# EasyEDA Pro project ProProject_TLE5012B_8pin_2024-05-29.epro

# Schematic Schematic1
Create Date: 2024-01-12; Page Name: P1; Project Name: TLE5012B_8pin; Schematic Name: Schematic1; Update Date: 2024-01-12; Company: 嘉立创EDA; Page Size: A4; Version: V1.0
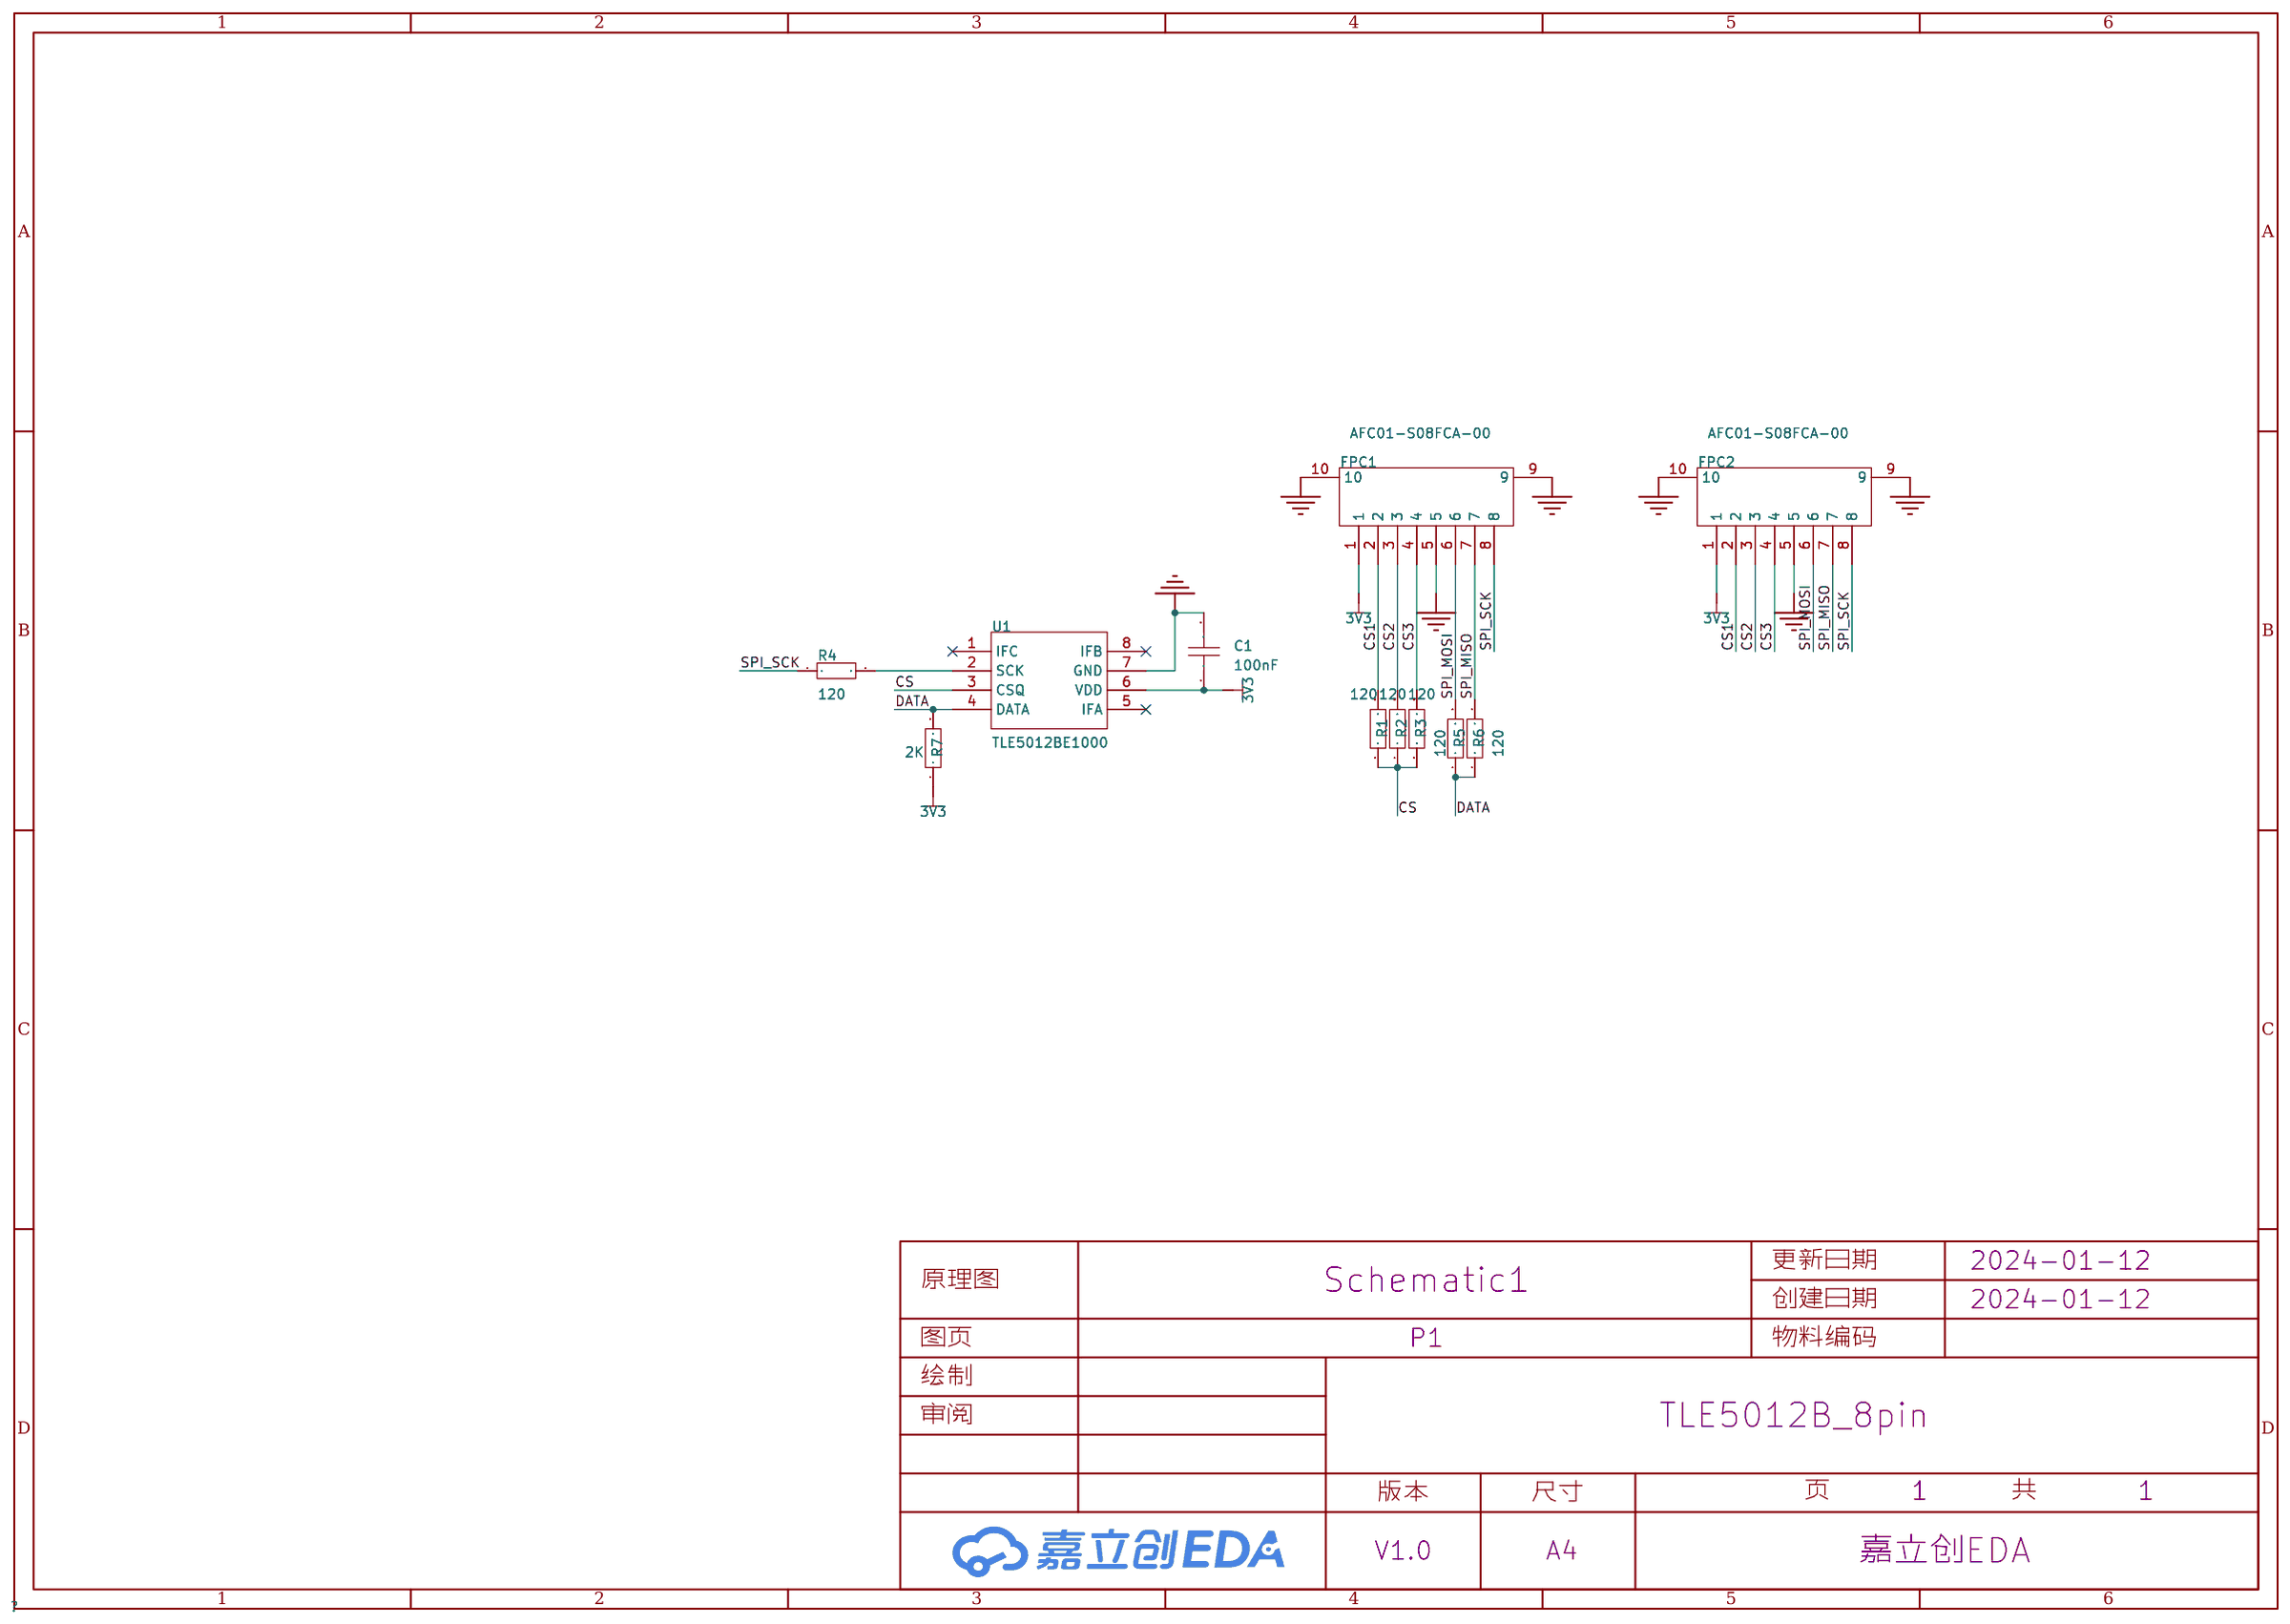
[diagram p0: schematic sheet]

## Parts
C1  100nF  [C0402]
FPC1  AFC01-S08FCA-00  [FPC-SMD_P0.50-8P_FGS-XJ-H2.0]
FPC2  AFC01-S08FCA-00  [FPC-SMD_P0.50-8P_FGS-XJ-H2.0]
R1  120  [R0402]
R2  120  [R0402]
R3  120  [R0402]
R4  120  [R0402]
R5  120  [R0402]
R6  120  [R0402]
R7  2K  [R0402]
U1  TLE5012BE1000  [PG-DSO-8_L5.0-W4.0-P1.27-LS6.0-BL]

## Library data of the parts
C1 = CAP_0402: Supplier Footprint: 0402
FPC1 FPC2 = AFC01-S08FCA-00: 间距:0.5mm;触点数量:8P;锁定特性:翻盖式;触点类型:下接;安装类型:卧贴;; LCSC Part Name: 间距:0.5mm P数:8P 翻盖式 下接; Supplier Part: C262657; Manufacturer: JS(钜硕电子); Supplier Footprint: SMD,P=0.5mm; JLCPCB Part Class: 扩展库; Datasheet: https://atta.szlcsc.com/upload/public/pdf/source/20190816/C413942_2A72D1AC756EAE17EEDF756A339D4500.pdf; Supplier: LCSC; Pitch: 0.5mm; Number of Contacts: 8P; Locking Feature: 翻盖式; FFC, FCB Thickness: 0.3mm; Contact Type: 下接; Mounting Type: 卧贴; Height Above Board: 2mm
R1-R7 = Res_0402: Supplier Footprint: 0402
U1 = TLE5012BE1000: 采用巨磁电阻的角度传感器; Supplier Part: C123083; Manufacturer: Infineon(英飞凌); Supplier Footprint: SO-8; JLCPCB Part Class: 扩展库; Datasheet: https://atta.szlcsc.com/upload/public/pdf/source/20170728/C123083_1501225763065848823.pdf; Supplier: LCSC

## Nets
3V3: C1.1 FPC1.1 FPC2.1 R7.1 U1.6(VDD)
GND: C1.2 FPC1.5 FPC1.9 FPC1.10 FPC2.5 FPC2.9 FPC2.10 U1.7(GND)
CS: R1.1 R2.1 R3.1 U1.3(CSQ)
CS1: FPC1.2 FPC2.2 R1.2
CS2: FPC1.3 FPC2.3 R2.2
CS3: FPC1.4 FPC2.4 R3.2
DATA: R5.1 R6.1 R7.2 U1.4(DATA)
SPI_MISO: FPC1.7 FPC2.7 R6.2
SPI_MOSI: FPC1.6 FPC2.6 R5.2
SPI_SCK: FPC1.8 FPC2.8 R4.1
$1N546: R4.2 U1.2(SCK)

Not connected (* = marked no-connect by the designer): U1 1(IFC)* 5(IFA)* 8(IFB)*

# Board PCB1
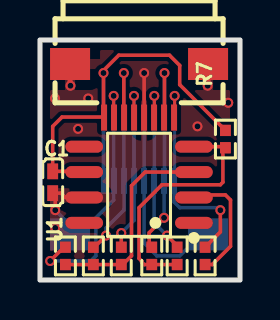
[diagram p1: board, top side]
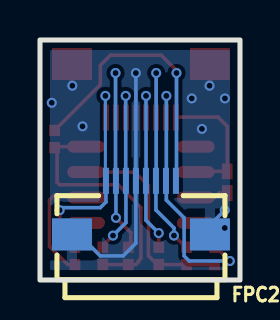
[diagram p2: board, bottom side, seen from below]

Outline 10 x 12 mm; copper layers: Top Layer, Bottom Layer. Coordinates in mm from the lower left corner of the outline.
Outline path: rectangle 0,12 10,0
Stack: Top Layer 0.035mm / Dielectric1 1.51mm FR4 er 4.5 / Bottom Layer 0.035mm

## Design rules (mm)
template: 自定义配置
spacing copperThickness1oz (default): track to track 0.102, other pairs 0.152 to 0.3
spacing copperThickness2oz: track to track 0.203, other pairs 0.152 to 0.3
track width copperThickness1oz (default): min 0.127, default 0.254, max 2.54
track width copperThickness2oz: min 0.203, default 0.254, max 2.54
differential pair differentialPair (default): width min 0.127, default 0.254, max 2.54; gap min 0.152, default 0.152
via viaSize (default): diameter min 0.5, default 0.5, max 10; hole min 0.3, default 0.3, max 6.299

## Placement (name value [footprint] x y rotation side)
C1  100nF  [C0402]  0.63 4.89 270 top
FPC1  AFC01-S08FCA-00  [FPC-SMD_P0.50-8P_FGS-XJ-H2.0]  4.95 9.46 0 top
FPC2  AFC01-S08FCA-00  [FPC-SMD_P0.50-8P_FGS-XJ-H2.0]  4.95 3.62 0 bottom
R1  120  [R0402]  1.27 1.2 90 top
R2  120  [R0402]  2.67 1.2 90 top
R3  120  [R0402]  4.06 1.2 90 top
R4  120  [R0402]  8.25 1.2 270 top
R5  120  [R0402]  6.86 1.2 90 top
R6  120  [R0402]  5.59 1.2 90 top
R7  2K  [R0402]  9.27 7.05 270 top
U1  TLE5012BE1000  [PG-DSO-8_L5.0-W4.0-P1.27-LS6.0-BL]  4.95 4.76 90 top

## Footprints (pads in the part's own frame, mm; a bottom-side part is the same pattern mirrored in y, then rotated)
C0402
  rect 0.79x0.54 smd: 1(-0.545,0) 2(0.545,0)
FPC-SMD_P0.50-8P_FGS-XJ-H2.0
  rect 0.3x1.3 smd: 1(-1.75,-1.34) 2(-1.252,-1.339) 3(-0.75,-1.34) 4(-0.25,-1.34) 5(0.25,-1.34) 6(0.75,-1.34) 7(1.25,-1.34) 8(1.75,-1.34)
  rect 2x1.6 smd: 9(3.45,1.34) 10(-3.45,1.34)
PG-DSO-8_L5.0-W4.0-P1.27-LS6.0-BL
  oval 0.602x1.885 smd: 1(-1.905,-2.743) 2(-0.635,-2.743) 3(0.635,-2.743) 4(1.905,-2.743) 5(1.905,2.743) 6(0.635,2.743) 7(-0.635,2.743) 8(-1.905,2.743)
R0402
  rect 0.566x0.54 smd: 1(-0.433,0) 2(0.433,0)

## Nets
As in the schematic.

Pads without a net: U1 1 5 8

## Via types
v1: diameter 0.5, hole 0.3, Top Layer to Bottom Layer, 23 vias

## Routing (per net, layer and track width the routed paths; a pad name or vN(x,y) marks a point on that pad's centre or on a via; arc(x,y) is an arc through that point)
3V3: length 22.9
  Top Layer w0.178: U1.6 2.17,5.43 C1.1 0.63,7.68 1.1,8.15 3.18,8.15 ; 3.18,8.15 FPC1.1 ; 3.18,8.15 v1(3.18,10.35) 3.18,10.48 3.94,11.24 6.48,11.24 6.99,10.73 6.99,9.77 R7.1
  Bottom Layer w0.178: FPC2.1 3.18,4.99 v1(3.18,10.35)
GND: length 20.9
  Top Layer w0.178: v1(5.21,10.35) 5.21,8.12 FPC1.5 ; U1.7 1.27,4.13 1.05,4.34 C1.2 0.76,4.22 v1(0.76,3.49)
  Top Layer w0.254: v1(1.52,9.71) 1.5,9.73 FPC1.10 ; v1(8.38,9.71) 8.4,9.73 FPC1.9
  Bottom Layer w0.178: v1(5.21,10.35) 5.21,4.96 FPC2.5 5.21,4.95 5.21,1.84 5.84,1.2 6.99,1.2 8.06,2.28 FPC2.9 ; v1(0.76,3.49) 1.5,2.75 FPC2.10
  vias: v1(0.75,9.08) v1(0.76,2.6) v1(1.91,7.56) v1(2.41,9.08) v1(7.87,7.68) v1(9.41,8.86)
CS: length 10.4
  Top Layer w0.178: U1.3 5.26,5.4 4.58,4.71 4.58,1.21 4.14,0.77 R3.1 R2.1 R1.1
CS1: length 12.9
  Top Layer w0.152: v1(3.68,9.21) 3.68,8.14 FPC1.2
  Top Layer w0.178: v1(0.51,0.95) 1.19,1.64 R1.2
  Bottom Layer w0.178: v1(3.68,9.21) 3.68,4.97 ; 3.68,4.97 FPC2.2 ; 3.68,4.97 3.68,4 2.79,3.11 2.79,1.2 2.54,0.95 v1(0.51,0.95)
CS2: length 11.6
  Top Layer w0.178: v1(3.3,2.22) 2.72,1.64 R2.2 ; v1(4.19,10.35) 4.19,8.13 FPC1.3
  Bottom Layer w0.178: v1(4.19,10.35) 4.19,4.97 FPC2.3 4.2,3.5 3.3,2.6 v1(3.3,2.22)
CS3: length 8.9
  Top Layer w0.152: FPC1.4 4.7,8.12 v1(4.7,9.21)
  Top Layer w0.178: v1(4.06,2.35) R3.2
  Bottom Layer w0.178: v1(4.06,2.35) 4.7,2.99 FPC2.4 4.7,4.96 v1(4.7,9.21)
DATA: length 12.7
  Top Layer w0.178: U1.4 9.22,6.67 R7.2 9.14,6.49 9.14,4.89 9.02,4.76 6.1,4.76 4.95,3.62 4.95,1.08 5.08,0.95 5.08,0.9 5.21,0.77 R6.1 R5.1
SPI_MISO: length 11.3
  Top Layer w0.178: v1(6.22,10.35) 6.22,8.14 FPC1.7 ; 5.46,1.64 5.46,2.37 v1(6.2,3.11)
  Bottom Layer w0.178: v1(6.22,10.35) 6.22,4.98 FPC2.7 v1(6.2,3.11)
SPI_MOSI: length 9.1
  Top Layer w0.152: v1(5.72,9.21) 5.72,8.13 FPC1.6
  Top Layer w0.178: v1(6.35,2.22) 6.86,1.71 R5.2
  Bottom Layer w0.178: v1(6.35,2.22) 5.7,2.87 FPC2.6 5.72,4.97 v1(5.72,9.21)
SPI_SCK: length 11.1
  Top Layer w0.152: v1(6.73,9.21) 6.73,8.15 FPC1.8
  Top Layer w0.178: R4.1 9.02,2.4 v1(9.02,3.49)
  Bottom Layer w0.152: FPC2.8 6.73,4.99 v1(6.73,9.21)
  Bottom Layer w0.178: FPC2.8 6.7,3.9 6.99,3.62 8.89,3.62 v1(9.02,3.49)
$1N546: length 6
  Top Layer w0.178: R4.2 8.61,0.77 9.53,1.68 9.53,4 9.27,4.25 7.82,4.25 U1.2

## Copper pours and planes (outline as drawn; the poured copper is in the pictures)
GND on Top Layer: -3.56,15.05 12.95,15.05 12.95,-3.62 -3.56,-3.62
GND on Bottom Layer: -4.57,15.43 13.21,15.43 13.21,-4.51 -4.57,-4.51

# Board PCB2
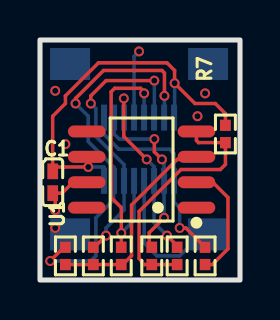
[diagram p3: board, top side]
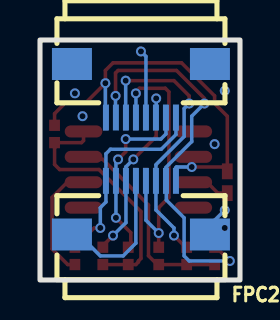
[diagram p4: board, bottom side, seen from below]

Outline 10 x 12 mm; copper layers: Top Layer, Bottom Layer. Coordinates in mm from the lower left corner of the outline.
Outline path: rectangle 0,12 10,0
Stack: Top Layer 0.035mm / Dielectric1 1.51mm FR4 er 4.5 / Bottom Layer 0.035mm

## Design rules (mm)
template: 自定义配置
spacing copperThickness1oz (default): track to track 0.102, other pairs 0.152 to 0.3
spacing copperThickness2oz: track to track 0.203, other pairs 0.152 to 0.3
track width copperThickness1oz (default): min 0.127, default 0.254, max 2.54
track width copperThickness2oz: min 0.203, default 0.254, max 2.54
differential pair differentialPair (default): width min 0.127, default 0.254, max 2.54; gap min 0.152, default 0.152
via viaSize (default): diameter min 0.5, default 0.5, max 10; hole min 0.3, default 0.3, max 6.299

## Placement (name value [footprint] x y rotation side)
C1  100nF  [C0402]  0.63 4.89 270 top
FPC1  AFC01-S08FCA-00  [FPC-SMD_P0.50-8P_FGS-XJ-H2.0]  4.95 9.46 180 bottom
FPC2  AFC01-S08FCA-00  [FPC-SMD_P0.50-8P_FGS-XJ-H2.0]  4.95 3.62 0 bottom
R1  120  [R0402]  1.27 1.2 90 top
R2  120  [R0402]  2.67 1.2 90 top
R3  120  [R0402]  4.06 1.2 90 top
R4  120  [R0402]  8.25 1.2 270 top
R5  120  [R0402]  6.86 1.2 90 top
R6  120  [R0402]  5.59 1.2 90 top
R7  2K  [R0402]  9.27 7.3 270 top
U1  TLE5012BE1000  [PG-DSO-8_L5.0-W4.0-P1.27-LS6.0-BL]  5.08 5.52 90 top

## Footprints (pads in the part's own frame, mm; a bottom-side part is the same pattern mirrored in y, then rotated)
C0402
  rect 0.79x0.54 smd: 1(-0.545,0) 2(0.545,0)
FPC-SMD_P0.50-8P_FGS-XJ-H2.0
  rect 0.3x1.3 smd: 1(-1.75,-1.34) 2(-1.252,-1.339) 3(-0.75,-1.34) 4(-0.25,-1.34) 5(0.25,-1.34) 6(0.75,-1.34) 7(1.25,-1.34) 8(1.75,-1.34)
  rect 2x1.6 smd: 9(3.45,1.34) 10(-3.45,1.34)
PG-DSO-8_L5.0-W4.0-P1.27-LS6.0-BL
  oval 0.602x1.885 smd: 1(-1.905,-2.743) 2(-0.635,-2.743) 3(0.635,-2.743) 4(1.905,-2.743) 5(1.905,2.743) 6(0.635,2.743) 7(-0.635,2.743) 8(-1.905,2.743)
R0402
  rect 0.566x0.54 smd: 1(-0.433,0) 2(0.433,0)

## Nets
3V3: C1.1 FPC1.1 FPC2.1 R7.1 U1.6
GND: C1.2 FPC1.5 FPC1.9 FPC1.10 FPC2.5 FPC2.9 FPC2.10 U1.7
CS: R1.1 R2.1 R3.1 U1.3
CS1: FPC1.2 FPC2.2 R1.2
CS2: FPC1.3 FPC2.3 R2.2
CS3: FPC1.4 FPC2.4 R3.2
DATA: R5.1 R6.1 R7.2 U1.4
SPI_MISO: FPC1.7 FPC2.7 R6.2
SPI_MOSI: FPC1.6 FPC2.6 R5.2
SPI_SCK: FPC1.8 FPC2.8 R4.1
$1N546: R4.2 U1.2

Pads without a net: U1 1 5 8

## Via types
v1: diameter 0.5, hole 0.299, Top Layer to Bottom Layer, 11 vias
v2: diameter 0.5, hole 0.3, Top Layer to Bottom Layer, 13 vias

## Routing (per net, layer and track width the routed paths; a pad name or vN(x,y) marks a point on that pad's centre or on a via; arc(x,y) is an arc through that point)
3V3: length 19.8
  Top Layer w0.178: v1(2.41,5.65) 0.85,5.65 C1.1 0.63,8.19 1.27,8.83 1.27,9.21 2.92,10.86 6.35,10.86 6.73,10.48 v1(6.73,9.84) 7.75,8.83 8.76,8.83 9.27,8.32 R7.1
  Bottom Layer w0.178: v1(6.73,9.84) 6.73,8.15 FPC1.1 ; FPC2.1 3.2,5.62 3.18,5.65 v1(2.41,5.65)
GND: length 14.2
  Top Layer w0.178: 1.78,4.76 1.52,4.76 1.11,4.34 C1.2 0.76,4.22 v2(0.76,3.49)
  Bottom Layer w0.178: v2(4.95,11.43) 4.7,11.18 FPC1.5 ; FPC2.5 5.21,4.95 5.21,1.84 5.84,1.2 6.99,1.2 8.06,2.28 FPC2.9 ; FPC2.10 1.5,2.75 v2(0.76,3.49)
  vias: v2(0.76,9.46) v2(0.76,2.6) v2(1.27,6.79) v2(7.87,8.19) v2(8.25,9.33)
CS: length 10.7
  Top Layer w0.178: 8.33,6.03 6.86,6.03 4.58,3.75 4.58,1.21 4.14,0.77 R3.1 R2.1 R1.1
CS1: length 19.8
  Top Layer w0.178: v2(0.51,0.95) 1.19,1.64 R1.2 ; v1(6.22,9.21) 6.22,10.35 6.1,10.48 3.18,10.48 1.78,9.08 v1(1.78,8.83)
  Bottom Layer w0.178: FPC1.2 6.22,8.14 v1(6.22,9.21) ; v1(1.78,8.83) 2.41,8.19 2.41,6.92 3.7,5.63 FPC2.2 3.68,4.97 3.68,4 2.79,3.11 2.79,1.2 2.54,0.95 v2(0.51,0.95)
CS2: length 14.3
  Top Layer w0.178: v1(5.72,9.97) 3.3,9.97 2.54,9.21 v1(2.54,8.83) ; R2.2 2.72,1.64 v2(3.3,2.22)
  Bottom Layer w0.178: v2(3.3,2.22) 3.3,2.6 4.2,3.5 FPC2.3 4.2,5.77 2.79,7.17 2.79,8.57 v1(2.54,8.83) ; v1(5.72,9.97) 5.72,8.13 FPC1.3
CS3: length 14
  Top Layer w0.178: v1(5.21,9.33) 5.21,9.41 5.03,9.59 3.73,9.59 3.56,9.41 3.56,4.13 4.06,3.62 v2(4.06,2.35) R3.2
  Bottom Layer w0.178: 4.7,4.96 FPC2.4 4.7,2.99 v2(4.06,2.35) ; v1(5.21,9.33) 5.2,9.33 FPC1.4
DATA: length 12.8
  Top Layer w0.178: R5.1 R6.1 5.21,0.77 5.08,0.9 5.08,0.95 4.95,1.08 4.95,3.43 7.05,5.52 9.02,5.52 9.27,5.78 9.27,6.61 9.22,6.67 9.22,6.82 R7.2 7.93,6.87 7.82,6.97 U1.4
SPI_MISO: length 8.9
  Top Layer w0.178: v1(6.1,6.03) 5.72,6.41 v1(5.72,7.05) ; 5.46,1.64 5.46,2.37 v2(6.2,3.11)
  Bottom Layer w0.178: v1(5.72,7.05) 3.96,7.05 3.7,7.3 FPC1.7 ; v1(6.1,6.03) 6.2,5.92 FPC2.7 v2(6.2,3.11)
SPI_MOSI: length 9.5
  Top Layer w0.178: R5.2 6.86,1.71 v2(6.35,2.22) ; v1(5.33,6.03) 4.19,7.17 v1(4.19,9.08)
  Bottom Layer w0.178: v1(5.33,6.03) 5.7,5.66 FPC2.6 ; FPC2.6 5.72,4.97 ; FPC2.6 5.7,2.87 v2(6.35,2.22) ; v1(4.19,9.08) 4.19,8.13 FPC1.6
SPI_SCK: length 10.2
  Top Layer w0.178: v2(6.99,2.6) 7.29,2.6 R4.1
  Bottom Layer w0.178: FPC1.8 3.2,7.27 3.94,6.54 6.48,6.54 6.7,6.31 FPC2.8 6.7,3.9 6.99,3.62 v2(6.99,2.6)
$1N546: length 5.9
  Top Layer w0.178: R4.2 8.61,0.77 9.4,1.56 9.4,4.13 8.64,4.89 U1.2

# Board PCB3
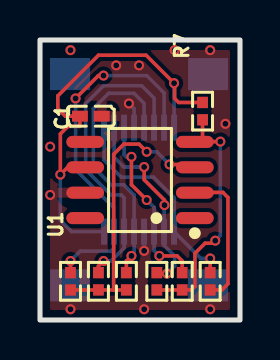
[diagram p5: board, top side]
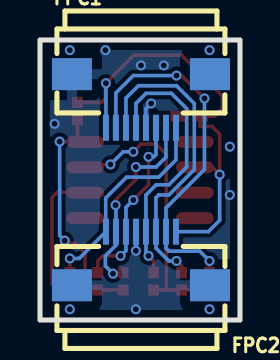
[diagram p6: board, bottom side, seen from below]

Outline 10 x 14 mm; copper layers: Top Layer, Bottom Layer. Coordinates in mm from the lower left corner of the outline.
Outline path: rectangle 0,14 10,0
Stack: Top Layer 0.035mm / Dielectric1 1.51mm FR4 er 4.5 / Bottom Layer 0.035mm

## Design rules (mm)
template: 自定义配置
spacing copperThickness1oz (default): track to track 0.102, other pairs 0.152 to 0.3
spacing copperThickness2oz: track to track 0.203, other pairs 0.152 to 0.3
track width copperThickness1oz (default): min 0.127, default 0.254, max 2.54
track width copperThickness2oz: min 0.203, default 0.254, max 2.54
differential pair differentialPair (default): width min 0.127, default 0.254, max 2.54; gap min 0.152, default 0.152
via viaSize (default): diameter min 0.5, default 0.5, max 10; hole min 0.3, default 0.3, max 6.299

## Placement (name value [footprint] x y rotation side)
C1  100nF  [C0402]  2.54 10.19 0 top
FPC1  AFC01-S08FCA-00  [FPC-SMD_P0.50-8P_FGS-XJ-H2.0]  4.95 10.95 180 bottom
FPC2  AFC01-S08FCA-00  [FPC-SMD_P0.50-8P_FGS-XJ-H2.0]  4.95 3.08 0 bottom
R1  120  [R0402]  1.52 1.94 90 top
R2  120  [R0402]  2.92 1.94 90 top
R3  120  [R0402]  4.32 1.94 90 top
R4  120  [R0402]  8.51 1.94 270 top
R5  120  [R0402]  7.11 1.94 90 top
R6  120  [R0402]  5.84 1.94 90 top
R7  2K  [R0402]  8.13 10.44 270 top
U1  TLE5012BE1000  [PG-DSO-8_L5.0-W4.0-P1.27-LS6.0-BL]  5 7 90 top

## Footprints (pads in the part's own frame, mm; a bottom-side part is the same pattern mirrored in y, then rotated)
C0402
  rect 0.79x0.54 smd: 1(-0.545,0) 2(0.545,0)
FPC-SMD_P0.50-8P_FGS-XJ-H2.0
  rect 0.3x1.3 smd: 1(-1.75,-1.34) 2(-1.252,-1.339) 3(-0.75,-1.34) 4(-0.25,-1.34) 5(0.25,-1.34) 6(0.75,-1.34) 7(1.25,-1.34) 8(1.75,-1.34)
  rect 2x1.6 smd: 9(3.45,1.34) 10(-3.45,1.34)
PG-DSO-8_L5.0-W4.0-P1.27-LS6.0-BL
  oval 0.602x1.885 smd: 1(-1.905,-2.743) 2(-0.635,-2.743) 3(0.635,-2.743) 4(1.905,-2.743) 5(1.905,2.743) 6(0.635,2.743) 7(-0.635,2.743) 8(-1.905,2.743)
R0402
  rect 0.566x0.54 smd: 1(-0.433,0) 2(0.433,0)

## Nets
3V3: C1.1 FPC1.1 FPC2.1 R7.1 U1.6
GND: C1.2 FPC1.5 FPC1.9 FPC1.10 FPC2.5 FPC2.9 FPC2.10 U1.7
CS: R1.1 R2.1 R3.1 U1.3
CS1: FPC1.2 FPC2.2 R1.2
CS2: FPC1.3 FPC2.3 R2.2
CS3: FPC1.4 FPC2.4 R3.2
DATA: R5.1 R6.1 R7.2 U1.4
SPI_MISO: FPC1.7 FPC2.7 R6.2
SPI_MOSI: FPC1.6 FPC2.6 R5.2
SPI_SCK: FPC1.8 FPC2.8 R4.1
$1N546: R4.2 U1.2

Pads without a net: U1 1 5 8

## Via types
v1: diameter 0.5, hole 0.299, Top Layer to Bottom Layer, 31 vias

## Routing (per net, layer and track width the routed paths; a pad name or vN(x,y) marks a point on that pad's centre or on a via; arc(x,y) is an arc through that point)
3V3: length 23.4
  Top Layer w0.178: 8.13,10.88 6.93,10.88 6.73,11.08 6.73,11.81 v1(6.7,11.84) 5.31,13.24 2.92,13.24 0.89,11.21 0.89,10.57 1.27,10.19 C1.1 2,9.68 1.4,9.68 1.02,9.3 v1(1.02,7.27) 1.38,7.64 U1.6
  Bottom Layer w0.178: FPC1.1 v1(6.7,11.84) ; v1(1.02,7.27) 1.02,4.98 1.58,4.42 FPC2.1
GND: length 2.3
  Bottom Layer w0.178: v1(4.44,10.83) 4.7,10.57 FPC1.5 ; FPC2.5 5.2,3.46 v1(5.21,3.46)
  vias: v1(0.51,8.67) v1(0.51,6.25) v1(1.52,13.49) v1(1.52,0.54) v1(3.81,12.73) v1(4.95,12.73) v1(5.21,0.54) v1(6.73,13.49) v1(8.51,13.49) v1(8.51,0.54) v1(9.27,9.81)
CS: length 14.3
  Top Layer w0.178: U1.3 7.6,7.78 v1(6.48,7.78) ; 3.67,1.5 R3.1 ; 3.67,1.5 R2.1 R1.1 ; 3.67,1.5 3.68,1.52 3.68,8.28 4.19,8.79 4.95,8.79 v1(5.33,8.41)
  Bottom Layer w0.178: v1(6.48,7.78) 5.84,8.41 v1(5.33,8.41)
CS1: length 18.3
  Top Layer w0.178: v1(3.18,12.22) 2.92,12.22 v1(1.78,11.08) ; v1(1.52,2.95) R1.2
  Bottom Layer w0.178: v1(1.52,2.95) 2.02,3.44 3.56,3.44 3.7,3.59 FPC2.2 3.7,5.6 1.78,7.52 v1(1.78,11.08) ; v1(3.18,12.22) 5.33,12.22 6.21,11.35 FPC1.2
CS2: length 15.8
  Top Layer w0.178: v1(3.18,2.95) 2.92,2.7 R2.2
  Bottom Layer w0.178: v1(3.18,2.95) 3.56,2.95 4.2,3.6 FPC2.3 4.2,6.11 4.06,6.25 3.56,6.25 2.29,7.52 2.29,10.83 3.18,11.71 5.08,11.71 5.7,11.09 FPC1.3
CS3: length 13.9
  Top Layer w0.178: v1(4.57,3.2) 4.32,2.95 R3.2
  Bottom Layer w0.178: FPC1.4 5.2,10.83 4.7,11.33 3.43,11.33 2.67,10.57 2.67,7.65 3.56,6.76 4.19,6.76 4.7,6.25 FPC2.4 4.7,3.34 v1(4.57,3.2)
DATA: length 12.4
  Top Layer w0.178: U1.4 7.76,8.92 8,8.92 ; R7.2 8.13,9.05 8,8.92 ; 8,8.92 v1(9.02,8.92) ; v1(8.76,3.97) 8.64,3.84 8.25,3.84 7.75,3.33 7.75,1.68 7.57,1.5 R5.1 R6.1
  Bottom Layer w0.178: v1(8.76,3.97) 9.02,4.22 v1(9.02,8.92)
SPI_MISO: length 9.8
  Top Layer w0.178: v1(5.21,7.65) 5.21,7.02 6.22,6 v1(6.22,5.75) ; v1(6.35,2.32) 5.89,2.32 R6.2
  Bottom Layer w0.178: v1(6.22,5.75) 6.2,5.72 FPC2.7 6.2,3.73 6.73,3.2 6.73,2.7 v1(6.35,2.32) ; FPC1.7 3.7,8.14 4.19,7.65 v1(5.21,7.65)
SPI_MOSI: length 9.1
  Top Layer w0.178: v1(5.33,6) 4.57,6.76 v1(4.57,8.16) ; v1(5.97,3.2) 6.86,3.2 7.11,2.95 R5.2
  Bottom Layer w0.178: FPC1.6 4.2,8.27 4.32,8.16 v1(4.57,8.16) ; v1(5.97,3.2) 5.7,3.47 FPC2.6 5.7,5.63 v1(5.33,6)
SPI_SCK: length 10.7
  Top Layer w0.178: v1(8.51,3.08) R4.1
  Bottom Layer w0.178: v1(8.51,3.08) 8.04,3.08 FPC2.8 6.71,4.43 6.71,6.1 5.67,7.14 4.06,7.14 3.2,8 FPC1.8
$1N546: length 7.1
  Top Layer w0.178: R4.2 9.09,1.5 9.4,1.81 9.4,6.13 9.14,6.38 7.76,6.38 U1.2

## Copper pours and planes (outline as drawn; the poured copper is in the pictures)
GND on Top Layer: -1.27,15.78 12.32,15.78 12.32,-0.86 -1.27,-0.86
GND on Bottom Layer: -2.54,16.16 14.99,16.16 14.99,-0.48 -2.54,-0.48
